# Altium schematic sheet Rele.SchDoc
size 420 x 297 mm
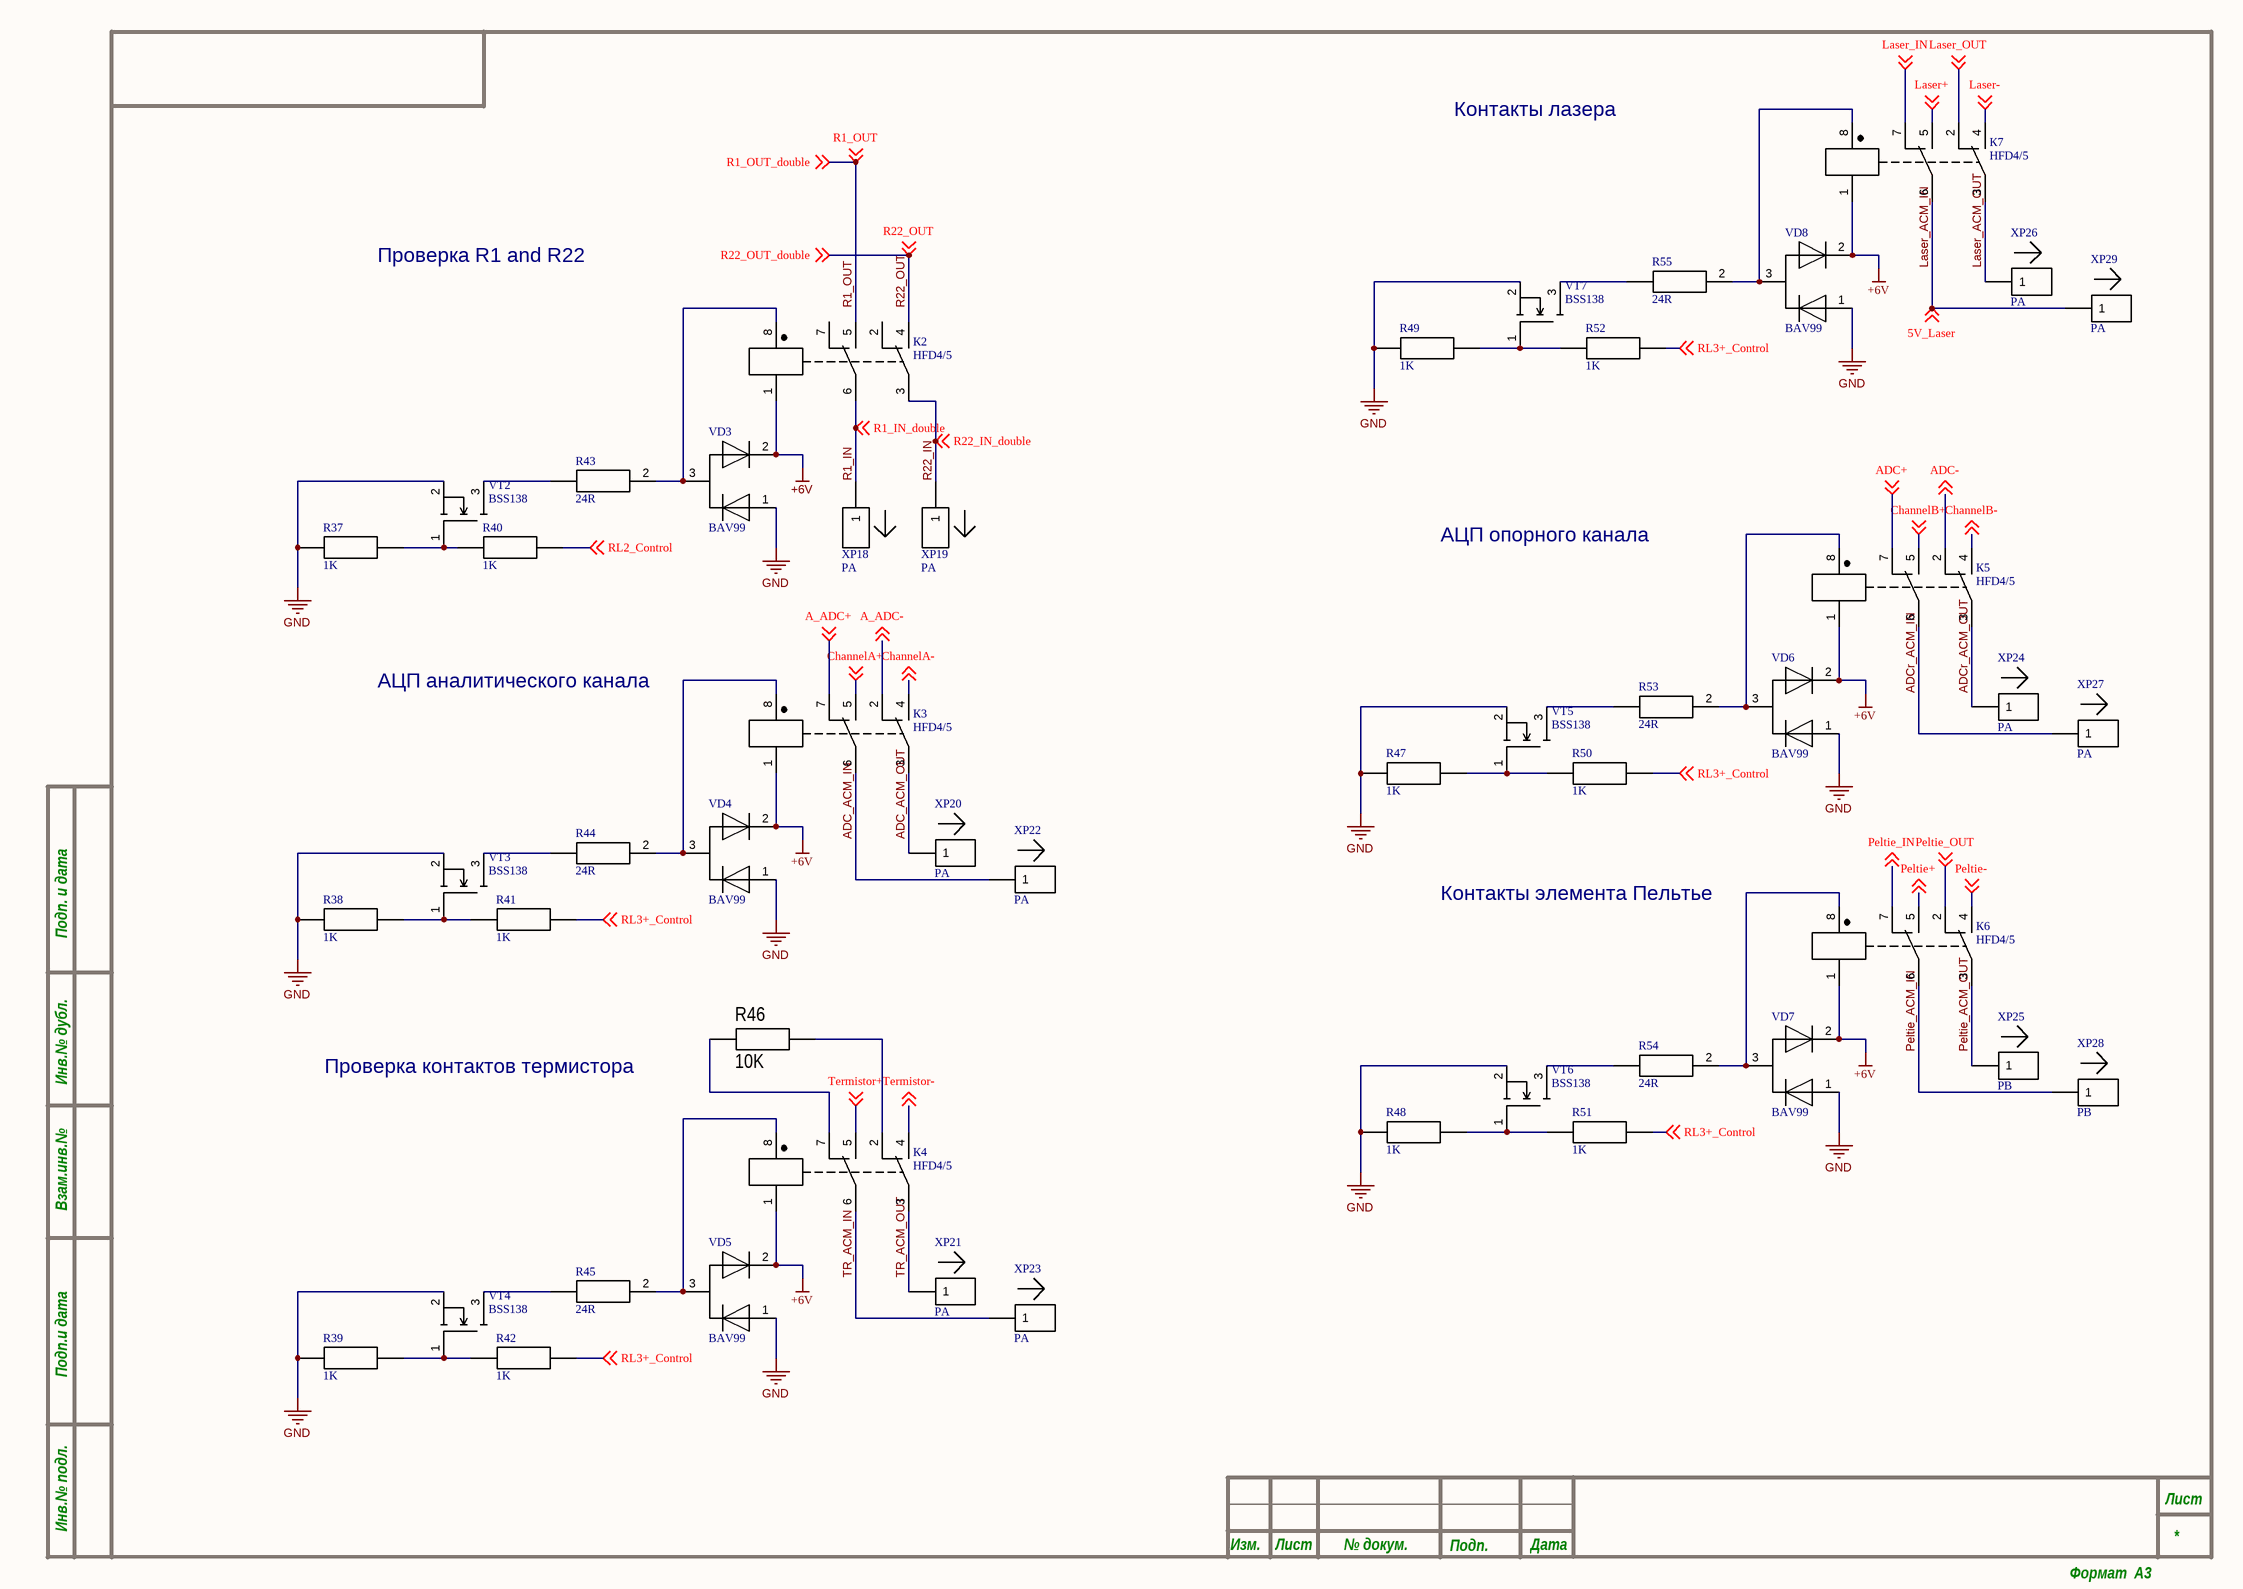
[diagram p0: Rele.SchDoc]

## Parts
R37  1K  [R0402]
R38  1K  [R0402]
R39  1K  [R0402]
R40  1K  [R0402]
R41  1K  [R0402]
R42  1K  [R0402]
R43  24R  [R0402]
R44  24R  [R0402]
R45  24R  [R0402]
R46  10K  [R0402]
R47  1K  [R0402]
R48  1K  [R0402]
R49  1K  [R0402]
R50  1K  [R0402]
R51  1K  [R0402]
R52  1K  [R0402]
R53  24R  [R0402]
R54  24R  [R0402]
R55  24R  [R0402]
VD3  BAV99  [SOT-23-3]
VD4  BAV99  [SOT-23-3]
VD5  BAV99  [SOT-23-3]
VD6  BAV99  [SOT-23-3]
VD7  BAV99  [SOT-23-3]
VD8  BAV99  [SOT-23-3]
VT2  BSS138  [SOT-23-3]
VT3  BSS138  [SOT-23-3]
VT4  BSS138  [SOT-23-3]
VT5  BSS138  [SOT-23-3]
VT6  BSS138  [SOT-23-3]
VT7  BSS138  [SOT-23-3]
XP18  PA  [POGO PIN P100-A2/B1]
XP19  PA  [POGO PIN P100-A2/B1]
XP20  PA  [POGO PIN P100-A2/B1]
XP21  PA  [POGO PIN P100-A2/B1]
XP22  PA  [POGO PIN P100-A2/B1]
XP23  PA  [POGO PIN P100-A2/B1]
XP24  PA  [POGO PIN P100-A2/B1]
XP25  PB  [POGO PIN P100-A2/B1]
XP26  PA  [POGO PIN P100-A2/B1]
XP27  PA  [POGO PIN P100-A2/B1]
XP28  PB  [POGO PIN P100-A2/B1]
XP29  PA  [POGO PIN P100-A2/B1]
К2  HFD4/5  [DIP-8]
К3  HFD4/5  [DIP-8]
К4  HFD4/5  [DIP-8]
К5  HFD4/5  [DIP-8]
К6  HFD4/5  [DIP-8]
К7  HFD4/5  [DIP-8]

## Nets
+6V: VD3.2 VD4.2 VD5.2 VD6.2 VD7.2 VD8.2 К2.1 К3.1 К4.1 К5.1 К6.1 К7.1
GND: R37.1 R38.1 R39.1 R47.1 R48.1 R49.1 VD3.1 VD4.1 VD5.1 VD6.1 VD7.1 VD8.1 VT2.2 VT3.2 VT4.2 VT5.2 VT6.2 VT7.2
A_ADC+: К3.7 ; off-sheet A_ADC+
A_ADC-: К3.2 ; off-sheet A_ADC-
ADC+: К5.7 ; off-sheet ADC+
ADC-: К5.2 ; off-sheet ADC-
ADC_ACM_IN: XP22.1 К3.6
ADC_ACM_OUT: XP20.1 К3.3
ADCr_ACM_IN: XP27.1 К5.6
ADCr_ACM_OUT: XP24.1 К5.3
ChannelA+: К3.5 ; off-sheet ChannelA+
ChannelA-: К3.4 ; off-sheet ChannelA-
ChannelB+: К5.5 ; off-sheet ChannelB+
ChannelB-: К5.4 ; off-sheet ChannelB-
Laser+: К7.5 ; off-sheet Laser+
Laser-: К7.4 ; off-sheet Laser-
Laser_ACM_IN: XP29.1 К7.6 ; off-sheet 5V_Laser  [also labelled 5V_Laser]
Laser_ACM_OUT: XP26.1 К7.3
Laser_IN: К7.7 ; off-sheet Laser_IN
Laser_OUT: К7.2 ; off-sheet Laser_OUT
Peltie+: К6.5 ; off-sheet Peltie+
Peltie-: К6.4 ; off-sheet Peltie-
Peltie_ACM_IN: XP28.1 К6.6
Peltie_ACM_OUT: XP25.1 К6.3
Peltie_IN: К6.7 ; off-sheet Peltie_IN
Peltie_OUT: К6.2 ; off-sheet Peltie_OUT
R1_IN: XP18.1 К2.6 ; off-sheet R1_IN_double  [also labelled R1_IN_double]
R1_OUT: К2.5 ; off-sheet R1_OUT_double, off-sheet R1_OUT  [also labelled R1_OUT_double]
R22_IN: XP19.1 К2.3 ; off-sheet R22_IN_double  [also labelled R22_IN_double]
R22_OUT: К2.4 ; off-sheet R22_OUT_double, off-sheet R22_OUT  [also labelled R22_OUT_double]
RL2_Control: R40.2 ; off-sheet RL2_Control
RL3+_Control: R41.2 R42.2 R50.2 R51.2 R52.2 ; off-sheet RL3+_Control
Termistor+: К4.5 ; off-sheet Termistor+
Termistor-: К4.4 ; off-sheet Termistor-
TR_ACM_IN: XP23.1 К4.6
TR_ACM_OUT: XP21.1 К4.3
NetR37_2: R37.2 R40.1 VT2.1
NetR38_2: R38.2 R41.1 VT3.1
NetR39_2: R39.2 R42.1 VT4.1
NetR43_1: R43.1 VT2.3
NetR43_2: R43.2 VD3.3 К2.8
NetR44_1: R44.1 VT3.3
NetR44_2: R44.2 VD4.3 К3.8
NetR45_1: R45.1 VT4.3
NetR45_2: R45.2 VD5.3 К4.8
NetR46_1: R46.1 К4.7
NetR46_2: R46.2 К4.2
NetR47_2: R47.2 R50.1 VT5.1
NetR48_2: R48.2 R51.1 VT6.1
NetR49_2: R49.2 R52.1 VT7.1
NetR53_1: R53.1 VT5.3
NetR53_2: R53.2 VD6.3 К5.8
NetR54_1: R54.1 VT6.3
NetR54_2: R54.2 VD7.3 К6.8
NetR55_1: R55.1 VT7.3
NetR55_2: R55.2 VD8.3 К7.8

Not connected (* = marked no-connect by the designer): К2 2 7

## Notes on the sheet
- Контакты лазера
- Проверка R1 and R22
- АЦП опорного канала
- АЦП аналитического канала
- Контакты элемента Пельтье
- Проверка контактов термистора
- Подп. и дата
- Инв.№ дубл.
- Взам.инв.№
- Подп.и дата
- Инв.№ подл.
- Изм.
- Лист
- № докум.
- Подп.
- Дата
- Формат  A3

## Library data of the parts
R37-R42 R47-R52 = R0402-1K: Resistor SMD 1K 1% 0402; Part Number: SMD RES 1 KOHM 1% ±100ppm/°C 0402; Added_by: irdolgopolowa@yandex.ru; Solder_Amount: 2; Pkg: 0402; Created_at: 29/10/24; MountType: SMD; Mount: MOUNT
R43-R45 R53-R55 = R0402-24R: Resistor SMD 24R 1% 0402; Part Number: SMD RES 24R OHM 1% ±100ppm/°C 0402; Added_by: Rutel@teslatec.ru; Solder_Amount: 2; Pkg: 0402; Created_at: 21/04/2020; MountType: SMD; Mount: MOUNT
R46 = R0402-10K: Resistor SMD 10K 1% 0402; Part Number: SMD RES 10 KOHM 1% ±100ppm/°C 0402; Added_by: Rutel@teslatec.ru; Solder_Amount: 2; Pkg: 0402; Created_at: 21/04/2020; MountType: SMD; Mount: MOUNT
VD3-VD8 = BAV99: BAV99, UMW, 70В, 200мА; Added_by: andrew@teslatec.ru; Solder_Amount: 3; Created_at: 29/06/2020; Mount: MOUNT; MountType: SMD; Pkg: SOT-23-3; Part Number: BAV99
VT2-VT7 = BSS138: N-Channel Logic Level Enhancement Mode Field Effect Transistor; Solder_Amount: 3; Added_by: ma_lubushkin@teslatec.ru; Pkg: SOT-23; Part Number: BSS138; Mount: MOUNT; MountType: SMD; Created_at: 03/12/2019
XP18-XP24 XP26 XP27 XP29 = P100-A2 / P100-A: Pogo pin, 33.35x1.36; Added_by: irdolgopolowa@yandex.ru; Created_at: 29/10/24; Mount: MOUNT; MountType: THM; Part Number: P100-A2 / P100-A; Pkg: *
XP25 XP28 = P100-B1: Pogo pin, 33.35x1.36; Added_by: irdolgopolowa@yandex.ru; Created_at: 29/10/24; Mount: MOUNT; MountType: THM; Part Number: P100-B1; Pkg: *
К2-К7 = HFD4/5: HFD4/5 (IM03TS) (1-1462037-8), 5VDC, 2A/250VAC DPDT; Part Number: HFD4/5SR; Added_by: irdolgopolowa@yandex.ru; Solder_Amount: 8; Created_at: 30/10/24; Mount: MOUNT; MountType: THM; Pkg: DIP-8